# Altium schematic sheet usb_to_rs232.SchDoc
size A3 portrait; ENG_APP_DATE: --/--/--; DSN_APP_DATE: --/--/--; CHK_APP_DATE: --/--/--; SheetNumber: 1; SheetTotal: 1
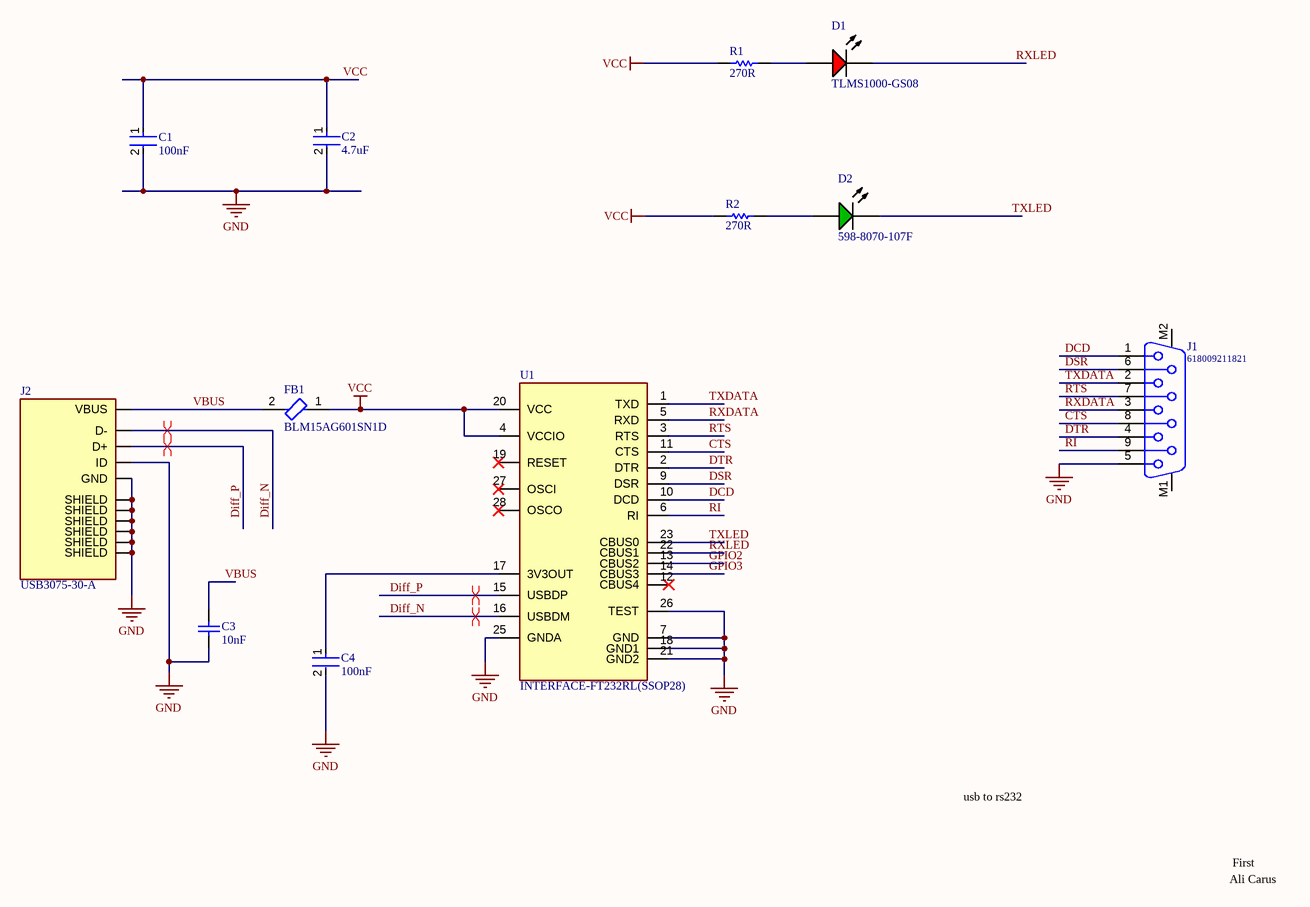
[diagram p0: usb_to_rs232.SchDoc]

## Parts
C1  100nF  [FP-CGA3E-0_3-0_1-IPC_A]
C2  4.7uF  [FP-GRM188-0_2-MFG]
C3  10nF  [CAPC1608X90X35ML10T15]
C4  100nF  [FP-CGA3E-0_3-0_1-IPC_A]
D1  TLMS1000-GS08  [VISH-TLMS1000_V]
D2  598-8070-107F  [DIAL-0603-2_V]
FB1  BLM15AG601SN1D  [FP-BLM15-0_05-MFG]
J1  618009211821  [618009211821]
J2  USB3075-30-A  [GCT_USB3075-30-A]
R1  270R  [RESC1608X55X30LL15T15]
R2  270R  [RESC1608X55X30LL15T15]
U1  INTERFACE-FT232RL(SSOP28)  [SSOP28-0.65-10.2X5.2MM]

## Nets
GND: C1.2 C2.2 C3.1 C4.2 J1.5 J2.4(ID) J2.5(GND) J2.S1(SHIELD) J2.S2(SHIELD) J2.S3(SHIELD) J2.S4(SHIELD) J2.S5(SHIELD) J2.S6(SHIELD) U1.7(GND) U1.18(GND1) U1.21(GND2) U1.25(GNDA) U1.26(TEST)
VCC: C1.1 C2.1 FB1.1 R1.2 R2.2 U1.4(VCCIO) U1.20(VCC)
CTS: J1.8 U1.11(CTS)
DCD: J1.1 U1.10(DCD)
Diff_N: J2.2(D-) U1.16(USBDM)
Diff_P: J2.3(D+) U1.15(USBDP)
DSR: J1.6 U1.9(DSR)
DTR: J1.4 U1.2(DTR)
GPIO2: U1.13(CBUS2)
GPIO3: U1.14(CBUS3)
RI: J1.9 U1.6(RI)
RTS: J1.7 U1.3(RTS)
RXDATA: J1.3 U1.5(RXD)
RXLED: D1.2(K) U1.22(CBUS1)
TXDATA: J1.2 U1.1(TXD)
TXLED: D2.1(K) U1.23(CBUS0)
VBUS: C3.2 FB1.2 J2.1(VBUS)
NetC4_1: C4.1 U1.17(3V3OUT)
NetD1_1: D1.1(A) R1.1
NetD2_2: D2.2(A) R2.1

Not connected (* = marked no-connect by the designer): J1 M1 M2; U1 12(CBUS4)* 19(RESET)* 27(OSCI)* 28(OSCO)*

## Layout directives
differential pair: Diff_N, Diff_P

## Notes on the sheet
- usb to rs232
- First
- Ali Carus
- DWG. NO.
- REV.
- SHT.
- REVISION
- DESCRIPTION
- DATE
- APPROVED
- THIS DOCUMENT AND THE DATA DISCLOSED HEREIN OR HEREWITH IS THE PROPERTY OF ALTIUM LIMITED AND MAY BE FREELY DISTRIBUTED IN WHOLE. NO RIGHTS ARE RESERVED OR EXPRESS OR IMPLIED WARANTEE GIVEN.
- ENG:
- DSN:
- APPROVALS
- PROJECT
- DOCUMENT REVISION:
- DESIGN ITEM:
- CHK:
- BOM:
- REFERENCE DOCUMENTS
- PROJECT REVISION:
- TITLE
- FAB DWG:
- PCB DWG:
- ASSY DWG:
- SCALE:
- SIZE
- D
- CAGE CODE
- FILE NAME
- DWG NO.
- SHEET
- OF
- REV

## Library data of the parts
C1 C4 = CMP-2000-04983-3: Cap Ceramic 100nF 100V X7S 10% Pad SMD 0603 +125°C Automotive T/R; Case Code (Metric): 1608; Termination: SMD/SMT; Capacitance: 100nF; Length: 1.6mm; Packaging: Tape and Reel; Weight: 7.1E-05oz; Ratings: AEC-Q200; Voltage Rating: 100V; Case/Package: 0603; Mount: Surface Mount; Radiation Hardening: No; Height: 0.8mm; Tolerance: 10%; REACH SVHC: No SVHC; Voltage Rating (DC): 100V; Dielectric: X7S; Case Code (Imperial): 0603; Depth: 0.8mm; Thickness: 0.035inch; Package Quantity: 1; Max Operating Temperature: 125°C; Lead Free: Lead Free; Width: 0.031inch; Min Operating Temperature: -55°C; Composition: Ceramic
C2 = CMP-2006-02545-2: Chip Multilayer Ceramic Capacitors for General Purpose, 0603, 4.7uF, X5R, 15%, 10%, 35V; Lead Free: Lead Free; Max Operating Temperature: 85°C; Case Code (Imperial): 0603; Capacitance: 4.7uF; Width: 0.8mm; Thickness: 0.031inch; Case Code (Metric): 1608; Min Operating Temperature: -55°C; Voltage Rating (DC): 35V; Dielectric: X5R; Voltage: 35V; Packaging: Tape and Reel; Resistor Type: Ceramic; Weight: 0.000222oz; Mount: Surface Mount; Material: Ceramic; Depth: 0.8mm; Tolerance: 10%; REACH SVHC: No SVHC; Case/Package: 0603; Voltage Rating: 35V; Package Quantity: 4000; Height: 0.8mm; Length: 1.6mm; Termination: SMD/SMT
C3 = CMP-2100-03642-1: Chip Capacitor, 10 nF, +/- 10%, 50 V, -55 to 125 degC, 0603 (1608 Metric), RoHS, Tape and Reel; Manufacturer: Murata; Insulation Resistance: 10GR; Dielectric: X7R; Voltage Rating: 50V; Material: Ceramic; Package Quantity: 1; Lead Free: LeadFree; Case/Package: 0603; Termination: SMD/SMT; REACH SVHC: Unknown; Manufacturer URL: http://www.murata.com/; Datasheet URL: http://search.murata.co.jp/Ceramy/image/img/A01X/G101/ENG/GRM188R71H103KA01-01.pdf; Mount: SurfaceMount; Datasheet Version: 42401.0; Number of Pins: 2; Length: 1.6mm; Voltage: 50V; Depth: 0.8mm; Tolerance: 10%; Min Operating Temperature: -55degC; Voltage Rating (DC): 50V; Max Operating Temperature: 125degC; Package Description: 2-Pin Surface Mount Device, Body 1.6 x 0.8 mm; RoHSCompliant: True; Case Code (Imperial): 0603; Width: 0.031inch; Case Code (Metric): 1608; Height: 0.8mm; Package Reference: 0603; Packaging: TapeandReel; Thickness: 0.035inch; Capacitance: 10nF; Dielectric Material: Ceramic
D1 = CMP-2000-07254-1: Low Current LED, 40 mW, 1.8 V, -40 to 100 degC, 2-Pin SMD (0603), RoHS, Tape and Reel; Manufacturer: Vishay; Lens Shape: Rectangular; Automotive Qualification Standard: AEC-Q100; Wavelength Typ: 636nm; SVHC: ToBeAdvised; LED Colour: Red; Bulb Size: 1.6mmx0.8mm; Forward Voltage: 1.8V; Luminous Intensity: 4mcd; Forward Current If: 2mA; Viewing Angle: 80°; Datasheet Version: Rev. 1.7, 02/2011; Datasheet URL: https://datasheet.ciiva.com/5798/1698881-5798337.pdf; LED Mounting: SMD; Packaging: CutTape; Package Reference: TLMS1000; Manufacturer URL: http://www.vishay.com/; Mounting Technology: SurfaceMount; Product Range: -; Package Description: 2-Pin Surface Mount Device, Body 1.6 x 0.8 mm; MSL: MSL2-1year
D2 = CMP-2000-05654-1: Single Color LED, 2 V, -30 to 85 degC, 2-Pin SMD (0603), RoHS, Tape and Reel; Manufacturer: Dialight; Power Dissipation: 60W; DELETED: Compliant; Number of  Elements: 1; Viewing Angle: 140deg; Dominant Wave Length: 568nm; Product Depth (mm): 0.8mm; Emitting Color: YellowGreen; Main Category: ChipLED; Product Length (mm): 1.6mm; Type: Uni-Color; Forward Voltage: 2.4V; Luminous Intensity: 20mcd; High Brightness: No; Forward Current: 25mA; Test Current (It): 20mA; Shape Type: Rectangular; Reverse Voltage: 5V; Product Height (mm): 0.7mm; Chip Material: GaP; Mounting: SurfaceMount; Package Description: 2-Pin Surface Mount Device, Body 1.6 x 0.8 mm; Package Type: SMD; Operating Temperature Classification: Industrial; Package Reference: 0603; Datasheet Version: Rev. 2, 10/2008; Lens Dimensions: 1.1x0.8x0.4mm; Pin Count: 2; Manufacturer URL: http://www.dialight.com/; Mounting Technology: SurfaceMount; Operating Temp Range: -40Cto100C; Packaging: TapeandReel; Rad Hardened: No; Datasheet URL: https://datasheet.ciiva.com/4688/598-selectorguide-18902-4688880.pdf; Lum Intensity: 20mcd
FB1 = CMP-0686-00187-4: Chip Ferrite Bead, 0402, 600Ω @ 100MHz, 0.52Ω, 25%, 300mA; DC Resistance-Max: 600mR; Number of Lines: 1; DC Resistance (DCR): 520mR; Shielding: Unshielded; Impedance: 600R; Material: Steel; Frequency: 100MHz; Lead Free: Lead Free; Max DC Current: 300mA; Test Frequency: 100MHz; Depth: 0.55mm; Length: 1mm; Case Code (Imperial): 0402; Packaging: Tape and Reel; Height: 0.5mm; Max Operating Temperature: 125°C; Military Standard: Not; REACH SVHC: No SVHC; Case Code (Metric): 1005; Series: BLM15AG_SN; Core Material: Ferrite; Termination: SMD/SMT; DC Current: 300mA; Package Quantity: 10000; Width: 0.5mm; RoHS Compliant: Yes; Min Operating Temperature: -55°C; Current Rating: 300mA; Case/Package: 0402; Number of Pins: 2; Radiation Hardening: No; Tolerance: 25%; Number of Circuits: 1; Max Current Rating: 300mA
J1 = 618009211821: WR-DSUB 8.08mm Female PCB Connector without Hex Screw, Angled, 9p; Manufacturer: Wurth Elektronik; Pin Number: 9; Rated Current: 3A; Contact Resistance: 30mOhm; Working Voltage: 125VAC; Withstanding Voltage: 1000VAC; ComponentLink1Description: Manufacturer; ComponentLink1URL: http://www.we-online.de; ComponentLink2Description: Datasheet; ComponentLink2URL: https://www.we-online.com/catalog/datasheet/618009211821.pdf; Manufacturer Part Number: 618009211821; Published Date: April 2021; Type: Angled; Operating Temperature: -55 to +105degC; Mounting Technology: THT; Gender: Female; Packaging: Tray
J2 = USB3075-30-A: USB - micro B USB 2.0 Receptacle Connector 5 Position Surface Mount, Right Angle; Through Hole; MF: Global Connector Technology; SnapEDA_Link: https://www.snapeda.com/parts/USB3075-30-A/Global%20Connector%20Technology/view-part/229370/?ref=snap; Value: *; Digi-Key_Part_Number: 2073-USB3075-30-ACT-ND; MP: USB3075-30-A; Digi-Key_Purchase_URL: https://www.digikey.com/product-detail/en/gct/USB3075-30-A/2073-USB3075-30-ACT-ND/9859705?utm_source=snapeda&utm_medium=aggregator&utm_campaign=symbol; Package: None
R1 R2 = CMP-2000-00388-1: Manufacturer: Panasonic; Part Number: ERJ3EKF2700V
U1 = INTERFACE-FT232RL(SSOP28): USB Bridge, USB to UART USB 2.0 UART Interface 28-SSOP; MF: FTDI, Future; SnapEDA_Link: https://www.snapeda.com/parts/FT232RL/FTDI%2C%20Future%20Technology%20Devices%20International%20Ltd/view-part/1077088/?ref=snap; Package: SSOP-28 FTDI, Future; MP: FT232RL; Price: None; Value: *; Availability: Unavailable